# Altium project Runaway_Alarm.PrjPcb (part 3 of 3)

## Sheet IMU.SchDoc
size A; SheetNumber: 7; SheetTotal: 10
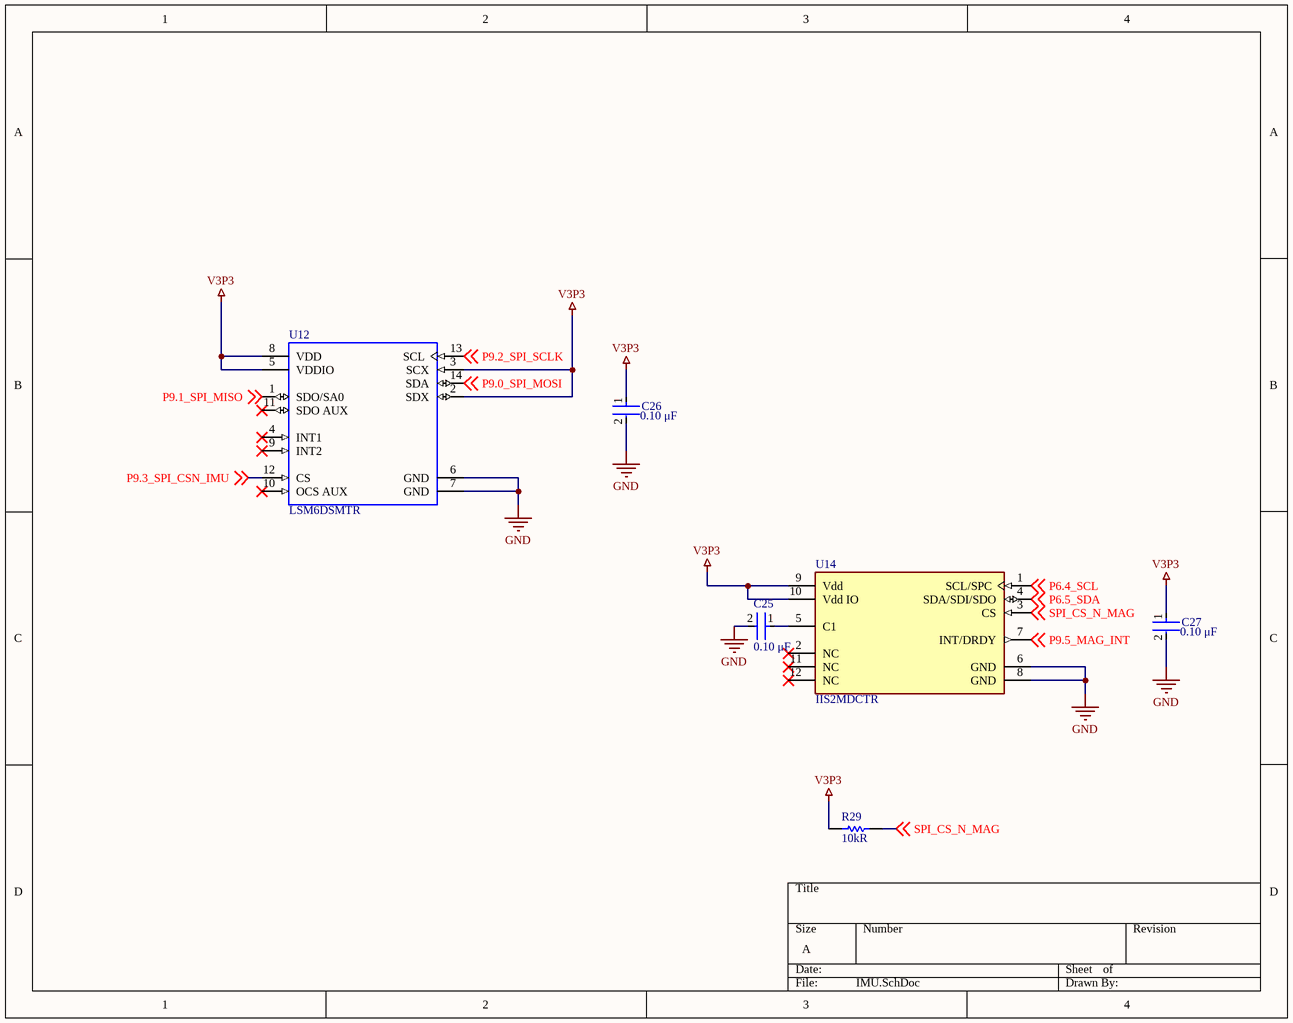
[diagram p6: IMU.SchDoc]

### Parts
C25  Capacitance: 0.10 μF  [FP-C0805C-DN-MFG]  (hidden comment: C0805C104K5RACTU)
C26  Capacitance: 0.10 μF  [FP-C0805C-DN-MFG]  (hidden comment: C0805C104K5RACTU)
C27  Capacitance: 0.10 μF  [FP-C0805C-DN-MFG]  (hidden comment: C0805C104K5RACTU)
R29  Resistance: 10kR  [RESC2013X60X35NL10T20]  (hidden comment: RC0805FR-0710KL)
U12  LSM6DSMTR  [LSM6DSMTR]
U14  IIS2MDCTR  [FP-LGA-12-DM00170568-MFG]

### Nets
GND: C25.2 C26.2 C27.2 U12.6(GND) U12.7(GND) U14.6(GND) U14.8(GND)
V3P3: C26.1 C27.1 R29.1 U12.2(SDX) U12.3(SCX) U12.5(VDDIO) U12.8(VDD) U14.9(Vdd) U14.10(Vdd_IO)
P6.4_SCL: U14.1(SCL/SPC) ; off-sheet P6.4_SCL
P6.5_SDA: U14.4(SDA/SDI/SDO) ; off-sheet P6.5_SDA
P9.0_SPI_MOSI: U12.14(SDA) ; off-sheet P9.0_SPI_MOSI
P9.1_SPI_MISO: U12.1(SDO/SA0) ; off-sheet P9.1_SPI_MISO
P9.2_SPI_SCLK: U12.13(SCL) ; off-sheet P9.2_SPI_SCLK
P9.3_SPI_CSN_IMU: U12.12(CS) ; off-sheet P9.3_SPI_CSN_IMU
P9.5_MAG_INT: U14.7(INT/DRDY) ; off-sheet P9.5_MAG_INT
SPI_CS_N_MAG: R29.2 U14.3(CS) ; off-sheet SPI_CS_N_MAG
NetC25_1: C25.1 U14.5(C1)

Not connected (* = marked no-connect by the designer): U12 4(INT1)* 9(INT2)* 10(OCS_AUX)* 11(SDO_AUX)*; U14 2(NC)* 11(NC)* 12(NC)*

### Library data of the parts
C25-C27 = CMP-2007-00279-2: CAP CER 0.1UF 50V X7R 0805; Manufacturer: KEMET; Value: 0.10 μF; Tolerance: 0.1; Temperature Coefficient: 30ppm/°C; Material: Ceramic; Voltage: 500V; Manufacturer Part Number: C0805C104K5RACTU; Device Class L2: Capacitors; Temperature Range Low: -55°C; Voltage Rating: 50 V; Digikey Description: CAP CER 0.1UF 50V X7R 0805; Category: Cap; ComponentLink2Description: Datasheet; Octopart: https://octopart.com/c0805c104k5ractu-kemet-143926; RoHS: TRUE; ComponentLink2URL: https://content.kemet.com/datasheets/KEM_C1003_C0G_SMD.pdf; Temperature Characteristic: X7R; Temperature: -55°C to +125°C; Height: 0.88mm; Temperature Range High: +125°C; Device Class L1: Passive Components; Automotive: No; Lead Free: Yes; Ipc Land Pattern Name: CAPC200125X78; Device Class L3: Ceramic Capacitors; Mouser Description: Cap Ceramic 0.1uF 50V X7R 10% SMD 2.0 x 1.2 mm 125 C Paper T/R; Package: C0805C-DN; Supplier: Digikey; Supplier Part Number: 399-C0805C104K5RAC7800CT-ND; Stock: 2466194; Pricing: 1=0.14, 10=0.091, 50=0.0546, 100=0.043, 500=0.03172, 1000=0.02627 (USD); Mounting Technology: Surface Mount,PCB; Case/Package: 0805; Pins: 2; Case Code (Imperial): 0805; Case Code (Metric): 2012; Min Operating Temperature: -55°C; Max Operating Temperature: 125°C; Dielectric: X7R; Package Quantity: 4000; Packaging: Tape and Reel; Voltage Rating (DC): 50V; Termination: SMD/SMT; Series: SMD Comm X7R; Construction: Flat; Length: 2mm; Width: 1.2mm; Depth: 1.25mm; Lead Pitch: 0.75mm; Radiation Hardening: No; RoHS Compliant: Yes; Reach SVHC Compliant: No; ComponentLink1URL: https://datasheet.ciiva.com/32431/slceramic-chip-condensers-e-32431755.pdf?src-supplier=Distrelec; ComponentLink1Description: https://datasheet.ciiva.com/32431/slceramic-chip-condensers-e-32431755.pdf?src-supplier=Distrelec; ComponentLink3URL: https://datasheet.ciiva.com/28682/1851736-28682232.pdf?src-supplier=Element14; ComponentLink3Description: https://datasheet.ciiva.com/28682/1851736-28682232.pdf?src-supplier=Element14; ComponentLink4URL: https://datasheet.ciiva.com/18410/70095383-18410815.pdf?src-supplier=Allied+Electronics; ComponentLink4Description: https://datasheet.ciiva.com/18410/70095383-18410815.pdf?src-supplier=Allied+Electronics; ComponentLink5URL: https://datasheet.ciiva.com/14589/70095383-14589048.pdf?src-supplier=Allied+Electronics; ComponentLink5Description: https://datasheet.ciiva.com/14589/70095383-14589048.pdf?src-supplier=Allied+Electronics
R29 = CMP-1659-00013-4: Chip Resistor, 10 KOhm, +/- 1%, 0.125 W, -55 to 155 degC, 0805 (2012 Metric), RoHS, Tape and Reel; Manufacturer: Yageo; Voltage Rating: 150 V; Power Rating: 125mW; Temperature Coefficient: 100ppm/°C; Mount: Surface Mount; ComponentLink1Description: Manufacturer URL; ComponentLink2URL: http://www.yageo.com/documents/recent/PYu-RC_Group_51_RoHS_L_04.pdf; Pins: 2; Length: 2 mm; Min Operating Temperature: -55 degC; Height: 0.5 mm; Mounting Technology: Surface Mount; RoHSCompliant: true; REACH SVHC: No SVHC; ComponentLink1URL: http://www.yageo.com/; Max Operating Temperature: 155 degC; PackageReference: 0805; DatasheetVersion: Rev. 4, 02/2016; Package Quantity: 5000; Packaging: Tape and Reel; ComponentLink2Description: Datasheet; PackageDescription: 2-Pin Surface Mounted Device, Body 2 x 1.25 mm; Supplier 1: Digi-Key; Supplier Part Number 1: 311-10.0KCRCT-ND; Manufacturer 1: Yageo; Manufacturer Part Number 1: RC0805FR-0710KL; RoHS: Yes; Category: Chip SMD Resistors; Stock 1: 12202331; Pricing 1: 1=0.10000, 10=0.03700, 100=0.01520, 1000=0.00682, 2500=0.00592 (USD); Case/Package: 0805; Case Code (Imperial): 0805; Case Code (Metric): 2012; Size Code: 0805; Tolerance: 1%; Termination: SMD/SMT; Series: RC; Max Power Dissipation: 125mW; Resistance Tolerance: 1%; Resistor Type: Thick Film; Number of Terminations: 2; Features: Moisture Resistant; Construction: Rectangular; Technology: THICK FILM; Width: 0.049inch; Depth: 1.25mm; RoHS Compliant: Yes; Lead Free: Lead Free; Military Standard: Not
U12 = IC-LSM6DSMTR: Analog Circuit, 1 Func, CMOS, PBGA14; Manufacturer: STMicroelectronics; Operating Supply Current: 0.29-0.65mA; Gyro Range: 125/250/500/1000/2000°/s; Sensor Output: I2C,SPI; Accel Range: 2/4/8/16g; Min Supply Voltage: 1.62V; Resolution: 16bits; Sensor Type: Temperature,Accelerometer,Gyroscope; Max Supply Voltage: 3.6V; Package Body Material: Plastic; Channels: 1; Nominal Supply Voltage: 1.8V; Manufacturer Part Number 1: LSM6DSMTR; Octopart: https://octopart.com/lsm6dsmtr-stmicroelectronics-66358194; Height: 0.86mm; Category: IC; Lead Free: Yes; Temperature: -40°C to +85°C; Temperature Range Low: -40°C; ComponentLink2Description: Datasheet; ComponentLink2URL: https://www.st.com/resource/en/datasheet/lsm6dsm.pdf; Digikey Description: IMU ACCEL/GYRO I2C/SPI 14LGA; Footprint Url: https://www.st.com/content/ccc/resource/technical/document/technical_note/73/17/9c/16/dd/96/4a/01/CD00134799.pdf/files/CD00134799.pdf/jcr:content/translations/en.CD00134799.pdf; Device Class L1: Sensors; Device Class L2: Motion Sensors; Temperature Range High: +85°C; Mouser Description: LSM6DSM Series 3.6 V I2C/SPI 3D Accelerometer and 3D Gyroscope - LGA-14; Device Class L3: Inertial Measurement Units (IMUs); Automotive: No; Package: LGA-14L-DM00249496; RoHS: TRUE; Supplier 1: Digikey; Supplier Part Number 1: 497-16696-1-ND; Stock: 16933; Pricing: 1=3.92, 10=2.965, 25=2.7248, 100=2.461, 250=2.33524, 500=2.25944, 1000=2.19705, 2500=2.13118 (USD); Case/Package: VFLGA; Pins: 14; Package Shape: Rectangular; Terminal Finish: Nickel; Min Operating Temperature: -40°C; Max Operating Temperature: 85°C; JESD-609 Code: e4; Throw Configuration: ANALOG CIRCUIT; Moisture Sensitivity Level: 3; Package Style: GRID ARRAY, VERY THIN PROFILE, FINE PITCHMeter; Peak Reflow Temperature (Cel): 260°C; Surface Mount: Yes; Technology: CMOS; Terminal Form: BUTT; Terminal Position: BOTTOM; Length: 3mm; Width: 2.5mm; Height - Seated (Max): 0.86mm; Terminal Pitch: 0.5mm; Temperature Grade: INDUSTRIAL; Reach SVHC Compliant: Yes; RoHS Compliant: Yes; ComponentLink1URL: https://datasheet.ciiva.com:443/pdfs/VipMasterIC/IC/SGST/SGST-S-A0003491949/SGST-S-A0003491926-1.pdf?src-supplier=IHS+Markit; ComponentLink1Description: https://datasheet.ciiva.com:443/pdfs/VipMasterIC/IC/SGST/SGST-S-A0003491949/SGST-S-A0003491926-1.pdf?src-supplier=IHS+Markit; ComponentLink3URL: http://www.farnell.com/datasheets/2151220.pdf?src-supplier=Farnell; ComponentLink3Description: http://www.farnell.com/datasheets/2151220.pdf?src-supplier=Farnell; ComponentLink4URL: https://www.mouser.com/ds/2/389/lsm6dsm-973702.pdf?src-supplier=Mouser; ComponentLink4Description: https://www.mouser.com/ds/2/389/lsm6dsm-973702.pdf?src-supplier=Mouser; ComponentLink5URL: http://www.st.com/content/ccc/resource/sales_and_marketing/promotional_material/flyer/7a/04/ee/af/e2/19/46/66/fllsm6dsm0216.pdf/files/fllsm6dsm0216.pdf/jcr:content/translations/en.fllsm6dsm0216.pdf?src-supplier=Digikey; ComponentLink5Description: http://www.st.com/content/ccc/resource/sales_and_marketing/promotional_material/flyer/7a/04/ee/af/e2/19/46/66/fllsm6dsm0216.pdf/files/fllsm6dsm0216.pdf/jcr:content/translations/en.fllsm6dsm0216.pdf?src-supplier=Digikey; ComponentLink6URL: http://www.st.com/content/ccc/resource/technical/document/datasheet/76/27/cf/88/c5/03/42/6b/DM00218116.pdf/files/DM00218116.pdf/jcr:content/translations/en.DM00218116.pdf?src-supplier=Digikey; ComponentLink6Description: http://www.st.com/content/ccc/resource/technical/document/datasheet/76/27/cf/88/c5/03/42/6b/DM00218116.pdf/files/DM00218116.pdf/jcr:content/translations/en.DM00218116.pdf?src-supplier=Digikey; ComponentLink7URL: https://datasheet.octopart.com/LSM6DSMTR-STMicroelectronics-datasheet-62333594.pdf?src-supplier=Newark; ComponentLink7Description: https://datasheet.octopart.com/LSM6DSMTR-STMicroelectronics-datasheet-62333594.pdf?src-supplier=Newark; ComponentLink8URL: http://www.farnell.com/datasheets/2151220.pdf?src-supplier=Newark; ComponentLink8Description: http://www.farnell.com/datasheets/2151220.pdf?src-supplier=Newark; ComponentLink9URL: https://datasheet.octopart.com/LSM6DSMTR-STMicroelectronics-datasheet-79471837.pdf?src-supplier=Future+Electronics; ComponentLink9Description: https://datasheet.octopart.com/LSM6DSMTR-STMicroelectronics-datasheet-79471837.pdf?src-supplier=Future+Electronics
U14 = CMP-12173-000003-1: SENSOR MR I2C/SPI 12LGA; Axis: X, Y, Z; Output Type: SPI; Sensing Method: Magnetoresistive; Resolution: 16b; Case/Package: LGA; Min Operating Temperature: -40°C; Packaging: Cut Tape; Number of Pins: 12; Max Operating Temperature: 85°C; RoHS Compliant: Yes

## Sheet Carrier_MCU.SchDoc: PSoC6
size A; Revision: A; SheetNumber: 8; SheetTotal: 10; ECE315_Project_Name: ECE453 F25 Staff Dev Board
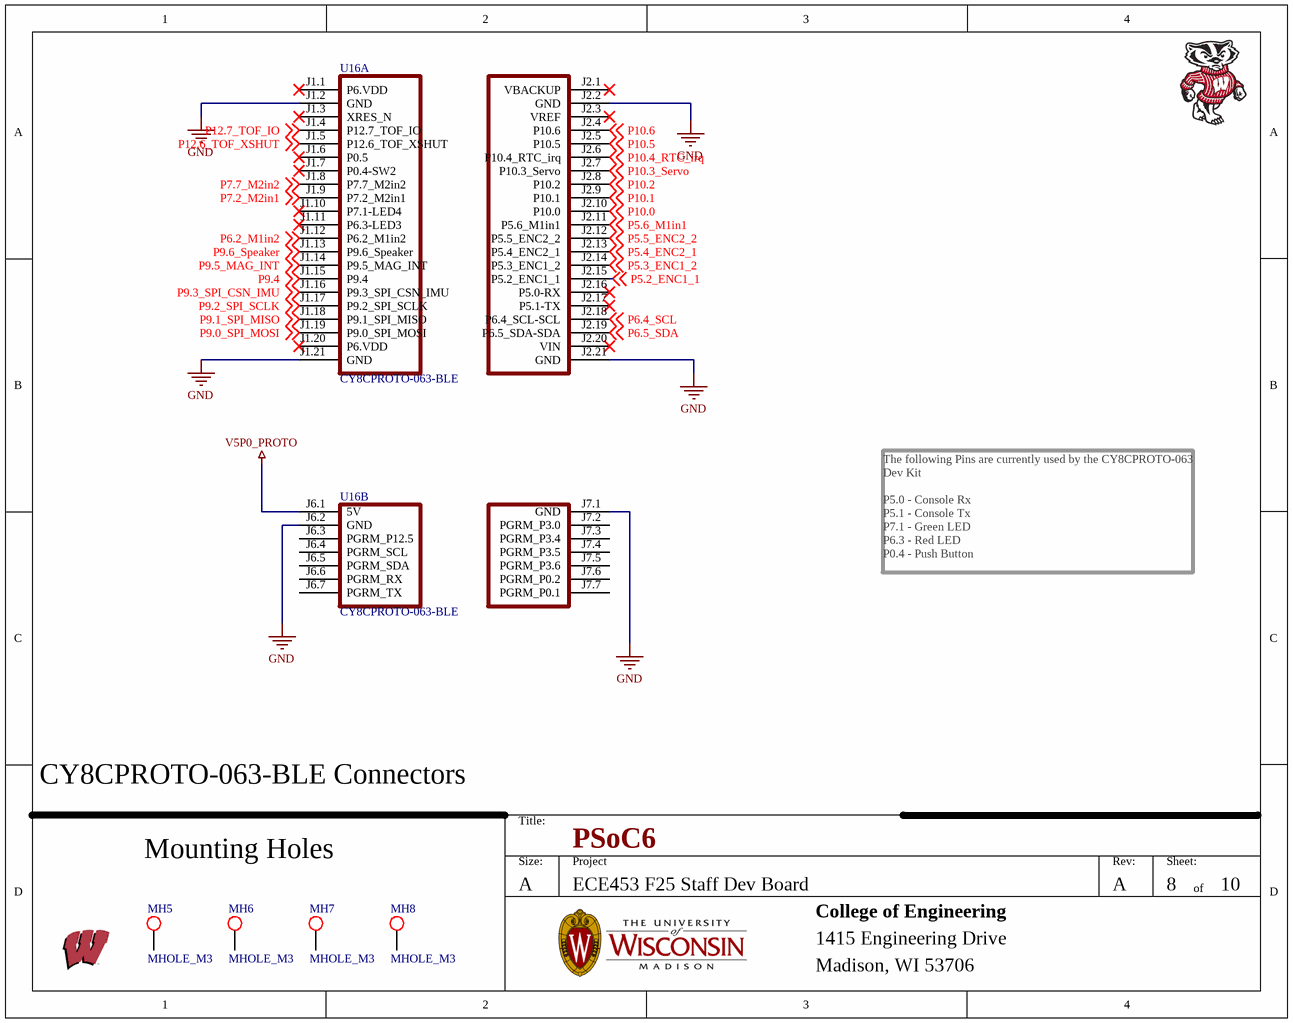
[diagram p7: Carrier_MCU.SchDoc]

### Parts
MH5  MHOLE_M3  [MHOLE_M3]  (no BOM)
MH6  MHOLE_M3  [MHOLE_M3]  (no BOM)
MH7  MHOLE_M3  [MHOLE_M3]  (no BOM)
MH8  MHOLE_M3  [MHOLE_M3]  (no BOM)
U16  CY8CPROTO-063-BLE  [CY8CPROTO-063-BLE]  (parts A,B of 2)  (no BOM)

### Nets
GND: U16.J1.2(GND) U16.J1.21(GND) U16.J2.2(GND) U16.J2.21(GND) U16.J6.2(GND) U16.J7.1(GND)
V5P0_PROTO: U16.J6.1(5V)
P5.2_ENC1_1: U16.J2.15(P5.2_ENC1_1) ; off-sheet P5.2_ENC1_1
P5.3_ENC1_2: U16.J2.14(P5.3_ENC1_2) ; off-sheet P5.3_ENC1_2
P5.4_ENC2_1: U16.J2.13(P5.4_ENC2_1) ; off-sheet P5.4_ENC2_1
P5.5_ENC2_2: U16.J2.12(P5.5_ENC2_2) ; off-sheet P5.5_ENC2_2
P5.6_M1in1: U16.J2.11(P5.6_M1in1) ; off-sheet P5.6_M1in1
P6.2_M1in2: U16.J1.12(P6.2_M1in2) ; off-sheet P6.2_M1in2
P6.4_SCL: U16.J2.18(P6.4_SCL-SCL) ; off-sheet P6.4_SCL
P6.5_SDA: U16.J2.19(P6.5_SDA-SDA) ; off-sheet P6.5_SDA
P7.2_M2in1: U16.J1.9(P7.2_M2in1) ; off-sheet P7.2_M2in1
P7.7_M2in2: U16.J1.8(P7.7_M2in2) ; off-sheet P7.7_M2in2
P9.0_SPI_MOSI: U16.J1.19(P9.0_SPI_MOSI) ; off-sheet P9.0_SPI_MOSI
P9.1_SPI_MISO: U16.J1.18(P9.1_SPI_MISO) ; off-sheet P9.1_SPI_MISO
P9.2_SPI_SCLK: U16.J1.17(P9.2_SPI_SCLK) ; off-sheet P9.2_SPI_SCLK
P9.3_SPI_CSN_IMU: U16.J1.16(P9.3_SPI_CSN_IMU) ; off-sheet P9.3_SPI_CSN_IMU
P9.4: U16.J1.15(P9.4) ; off-sheet P9.4
P9.5_MAG_INT: U16.J1.14(P9.5_MAG_INT) ; off-sheet P9.5_MAG_INT
P9.6_Speaker: U16.J1.13(P9.6_Speaker) ; off-sheet P9.6_Speaker
P10.0: U16.J2.10(P10.0) ; off-sheet P10.0
P10.1: U16.J2.9(P10.1) ; off-sheet P10.1
P10.2: U16.J2.8(P10.2) ; off-sheet P10.2
P10.3_Servo: U16.J2.7(P10.3_Servo) ; off-sheet P10.3_Servo
P10.4_RTC_irq: U16.J2.6(P10.4_RTC_irq) ; off-sheet P10.4_RTC_irq
P10.5: U16.J2.5(P10.5) ; off-sheet P10.5
P10.6: U16.J2.4(P10.6) ; off-sheet P10.6
P12.6_TOF_XSHUT: U16.J1.5(P12.6_TOF_XSHUT) ; off-sheet P12.6_TOF_XSHUT
P12.7_TOF_IO: U16.J1.4(P12.7_TOF_IO) ; off-sheet P12.7_TOF_IO

Not connected (* = marked no-connect by the designer): MH5 1; MH6 1; MH7 1; MH8 1; U16 J1.1(P6.VDD)* J1.3(XRES_N)* J1.6(P0.5)* J1.7(P0.4-SW2)* J1.10(P7.1-LED4)* J1.11(P6.3-LED3)* J1.20(P6.VDD)* J2.1(VBACKUP)* J2.3(VREF)* J2.16(P5.0-RX)* J2.17(P5.1-TX)* J2.20(VIN)* J6.3(PGRM_P12.5) J6.4(PGRM_SCL) J6.5(PGRM_SDA) J6.6(PGRM_RX) J6.7(PGRM_TX) J7.2(PGRM_P3.0) J7.3(PGRM_P3.4) J7.4(PGRM_P3.5) J7.5(PGRM_P3.6) J7.6(PGRM_P0.2) J7.7(PGRM_P0.1)

### Notes on the sheet
- The following Pins are currently used by the CY8CPROTO-063 Dev Kit
  P5.0 - Console Rx
  P5.1 - Console Tx
  P7.1 - Green LED
  P6.3 - Red LED
  P0.4 - Push Button
- CY8CPROTO-063-BLE Connectors
- Mounting Holes
- Title:
- Size:
- A
- Project
- Rev:
- Sheet:
- of
- College of Engineering
- 1415 Engineering Drive
- Madison, WI 53706

### Library data of the parts
MH5-MH8 = MHOLE_M3: Mounting Hole - M3 Metric
U16 = IC_CY8CPROTO-063-BLE

## Sheet Carrier_Power.SchDoc: Power
size A; Revision: A; SheetNumber: 11; SheetTotal: 12; ECE315_Project_Name: ECE453 F25 Staff Dev Board
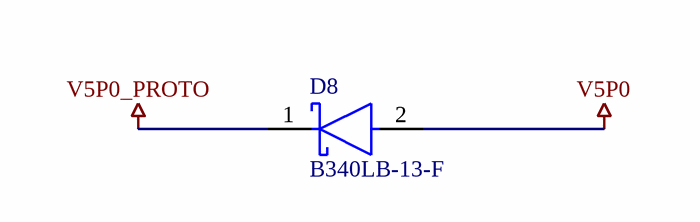
[diagram p8: Carrier_Power.SchDoc]

### Parts
D8  B340LB-13-F  [FP-SMB-MFG]

### Nets
V5P0: D8.2(A)
V5P0_PROTO: D8.1(C)

### Notes on the sheet
- Title:
- Size:
- A
- Project
- Rev:
- Sheet:
- of
- College of Engineering
- 1415 Engineering Drive
- Madison, WI 53706

### Library data of the parts
D8 = CMP-12790-000022-1: DIODE SCHOTTKY 40V 3A SMB; Manufacturer: Diodes Inc.; Max Surge Forward Current: 70A; Value: 180pF; Peak Reverse Current: 2mA; Standoff Height: 0.05mm; Max Junction Temp: +150°C; Device Class L2: Diodes; Octopart: https://octopart.com/b340lb-13-f-diodes+inc.-325823; Device Class L1: Discrete Semiconductors; Forward Current: 3A; Automotive: No; Manufacturer Part Number: B340LB-13-F; Temperature: -55°C to +150°C; Temperature Range Low: -55°C; Max Repetitive Reverse Voltage: 40V; Device Class L3: Schottky Diodes; RoHS: TRUE; Height: 2.5mm; ComponentLink2URL: https://www.diodes.com/assets/Datasheets/ds30240.pdf; Package: SMB; Digikey Description: DIODE SCHOTTKY 40V 3A SMB; Lead Free: Yes; Category: Diode; Reverse Voltage: 40V; Mouser Description: Schottky Diodes & Rectifiers 40V 3A; ComponentLink2Description: Datasheet; Footprint Url: https://www.diodes.com/assets/Package-Files/SMB.pdf; Temperature Range High: +150°C; Capacitance: 180pF

## Sheet Speaker.SchDoc
size A; SheetNumber: 11; SheetTotal: 11
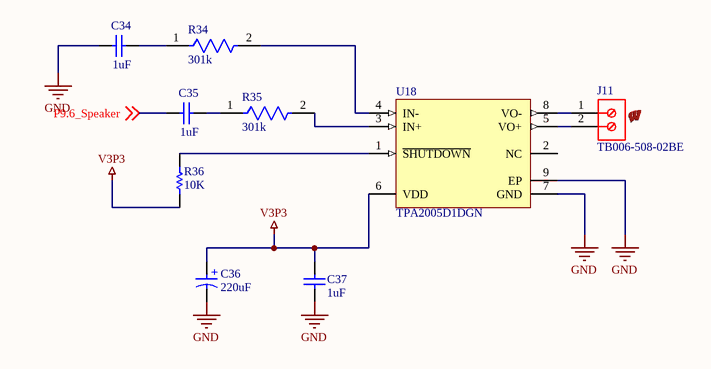
[diagram p9: Speaker.SchDoc]

### Parts
C34  1uF  [CAPC2013X145X50NL20T25]
C35  1uF  [CAPC2013X145X50NL20T25]
C36  220uF  [WCAP-AS5H_D6.3H7.7]
C37  1uF  [CAPC2013X145X50NL20T25]
J11  Manufacturer Part Number: TB006-508-02BE  [CUI_TB006 -508-02BE]  (hidden comment: CONN_TB006_-508-02BE)
R34  301k  [FP-CRCW1206-Pe3-MFG]
R35  301k  [FP-CRCW1206-Pe3-MFG]
R36  10K  [RESC2013X55X40ML15T20]
U18  TPA2005D1DGN  [DGN0008D_L]

### Nets
GND: C34.1 C36.2(N) C37.1 U18.7(GND) U18.9(EP)
V3P3: C36.1(P) C37.2 R36.1 U18.6(VDD)
P9.6_Speaker: C35.1 ; off-sheet P9.6_Speaker
NetC34_2: C34.2 R34.1
NetC35_2: C35.2 R35.1
NetJ11_1: J11.1 U18.8(VO-)
NetJ11_2: J11.2 U18.5(VO+)
NetR34_2: R34.2 U18.4(IN-)
NetR35_2: R35.2 U18.3(IN+)
NetR36_2: R36.2 U18.1(~{SHUTDOWN})

Not connected (* = marked no-connect by the designer): U18 2(NC)

### Notes on the sheet
- (in symbol CMP-03913-53914664-1) +

### Library data of the parts
C34 C35 C37 = CMP-2007-01227-1: Manufacturer: Kemet; Part Number: C0805S104K5RACTU
C36 = CMP-03913-53914664-1: 865230145005 WCAP-AS5H Aluminum Electrolytic Capacitors; Insulation Resistance: 454.545kΩ; Ripple Current (AC): 110mA; Leakage Current: 13.86µA; Life (Hours): 5000hours; Voltage Rating (DC): 6.3V; Capacitance: 220µF; Ripple Current: 110mA; Diameter: 6.3mm; NexarPartId: 53914664; Packaging: Cut Tape; Height: 7.7mm; Max Operating Temperature: 105°C; REACH SVHC: Unknown; RoHS: Compliant; Width: 6.6mm; Length: 7.7mm; Case/Package: Radial; Voltage Rating: 6.3V; Min Operating Temperature: -40°C
J11 = CONN_TB006_-508-02BE: 2~24 Poles, Screw Type, Horizontal, 5.08 Pitch, 26~14 (AWG), Terminal Block Connector; MF: CUI Devices; MP: TB006 -508-02BE; CUI_purchase_URL: https://www.cuidevices.com/product/interconnect/connectors/terminal-blocks/tb006-508-series?utm_source=snapeda.com&utm_medium=referral&utm_campaign=snapedaBOM; Value: *; Check_prices: https://www.snapeda.com/parts/TB006%20-508-02BE/CUI+Devices/view-part/?ref=eda; SnapEDA_Link: https://www.snapeda.com/parts/TB006%20-508-02BE/CUI+Devices/view-part/?ref=snap; Availability: In Stock; Package: None; Purchase-URL: https://pricing.snapeda.com/search/part/TB006 -508-02BE/?ref=eda; Price: None; Supplier: Digikey; Supplier Part Number: 102-6191-ND; Manufacturer: CUI Devices; RoHS: Yes; Category: Terminal Blocks; Stock: 47249; Pricing: 1=0.73, 10=0.402, 25=0.3, 50=0.2676, 100=0.2623, 250=0.23084, 500=0.20984, 1000=0.18886, 5000=0.14164 (USD)
R34 R35 = CMP-03613-000233-1: RES Thick Film, 301kΩ, 1%, 0.25W, 50ppm/°C, 1206; Resistance: 301kR; Max Power Dissipation: 250mW; Number of Terminations: 2; Series: CRCW-P; Resistor Type: Thick Film; RoHS Compliant: Yes; Max Operating Temperature: 155°C; Features: Automotive AEC-Q200; Case/Package: 1206; Packaging: Tape and Reel; Package Quantity: 5000; Tolerance: 1%; Min Operating Temperature: -55°C; Temperature Coefficient: 50ppm/°C; Width: 0.063inch; Height: 0.024inch; Length: 0.126inch
R36 = CMP-2001-04711-1: Part Number: TNPW0805301KBEEN; Manufacturer: Vishay Dale
U18 = CMP-0991-00091-2: 1.4-W Mono Class-D Audio Amplifier, -40 to 85 degC, 8-pin SOP (DGN8), Green (RoHS & no Sb/Br); Manufacturer: Texas Instruments; Supply Min(Min)(Volt): 2.5; SubFamily: Dynamic Speaker; Supply Max(Max)(Volt): 5.5; Output Power(W): 1.18; PSRR(dB): -75; ComponentLink1Description: Manufacturer URL; Mounting Technology: Surface Mount; Code_JEDEC: MO-187; PackageReference: DGN0008D; PackageDescription: 8-Pin Plastic Small Outline, Body 3 x 3 mm, Pitch 0.65 mm; Eco-Plan: Green (RoHS & no Sb/Br); ComponentLink3Description: Package Specification; ComponentLink1URL: http://www.ti.com/; PackageVersion: 4073271/F, 05/2011; ComponentLink2Description: Datasheet; DatasheetVersion: SLOS369F; Speaker Amp Type: Class-D; Speaker Channels: Mono; PartNumber: TPA2005D1DGN; ComponentLink3URL: http://www.ti.com/litv/pdf/mpds046e; ComponentLink2URL: http://www.ti.com/general/docs/lit/getliterature.tsp?genericPartNumber=TPA2005D1&fileType=pdf

## Nets that join several sheets
GND: 02-RTC (5 pins), 03-Batteries (5 pins), 04-Power-V3P3 (9 pins), 05-Power-V5P0 (9 pins), driver1 (11 pins), driver2 (10 pins), IMU (7 pins), Carrier_MCU (6 pins), Speaker (5 pins)
V3P3: 02-RTC (5 pins), 03-Batteries (TOF.2 V3P3.1), 04-Power-V3P3 (5 pins), driver1 (C4.1 ENC1.1 U10.4), driver2 (C28.1 ENC2.1 U11.4), IMU (9 pins), Speaker (C36.1 C37.2 R36.1 U18.6)
V5P0: 03-Batteries (LCD.2 SERVO1.2 V5P0.1), 05-Power-V5P0 (5 pins), Carrier_Power (D8.2)
V5P0_PROTO: Carrier_MCU (U16.J6.1), Carrier_Power (D8.1)
VBATT: 03-Batteries (BT2.P VBATT.1), 04-Power-V3P3 (Q1.3 R12.2), 05-Power-V5P0 (Q2.3 R16.2), driver1 (6 pins), driver2 (5 pins)
P5.2_ENC1_1: driver1 (ENC1.2), Carrier_MCU (U16.J2.15)
P5.3_ENC1_2: driver1 (ENC1.3), Carrier_MCU (U16.J2.14)
P5.4_ENC2_1: driver2 (ENC2.2), Carrier_MCU (U16.J2.13)
P5.5_ENC2_2: driver2 (ENC2.3), Carrier_MCU (U16.J2.12)
P5.6_M1in1: driver1 (U10.3), Carrier_MCU (U16.J2.11)
P6.2_M1in2: driver1 (U10.2), Carrier_MCU (U16.J1.12)
P6.4_SCL: 02-RTC (R1.2 U1.6), 03-Batteries (LCD.4 SCL.1 TOF.3), IMU (U14.1), Carrier_MCU (U16.J2.18)
P6.5_SDA: 02-RTC (R2.2 U1.5), 03-Batteries (LCD.3 SDA.1 TOF.4), IMU (U14.4), Carrier_MCU (U16.J2.19)
P7.2_M2in1: driver2 (U11.3), Carrier_MCU (U16.J1.9)
P7.7_M2in2: driver2 (U11.2), Carrier_MCU (U16.J1.8)
P9.0_SPI_MOSI: IMU (U12.14), Carrier_MCU (U16.J1.19)
P9.1_SPI_MISO: IMU (U12.1), Carrier_MCU (U16.J1.18)
P9.2_SPI_SCLK: IMU (U12.13), Carrier_MCU (U16.J1.17)
P9.3_SPI_CSN_IMU: IMU (U12.12), Carrier_MCU (U16.J1.16)
P9.4: 03-Batteries (Exposed_Pins.1), Carrier_MCU (U16.J1.15)
P9.5_MAG_INT: IMU (U14.7), Carrier_MCU (U16.J1.14)
P9.6_Speaker: Carrier_MCU (U16.J1.13), Speaker (C35.1)
P10.0: 03-Batteries (Exposed_Pins.2), Carrier_MCU (U16.J2.10)
P10.1: 03-Batteries (Exposed_Pins.3), Carrier_MCU (U16.J2.9)
P10.2: 03-Batteries (Exposed_Pins.4), Carrier_MCU (U16.J2.8)
P10.3_Servo: 03-Batteries (SERVO1.3), Carrier_MCU (U16.J2.7)
P10.4_RTC_irq: 02-RTC (R3.2 U1.7), Carrier_MCU (U16.J2.6)
P10.5: 03-Batteries (Exposed_Pins.5), Carrier_MCU (U16.J2.5)
P10.6: 03-Batteries (Exposed_Pins.6), Carrier_MCU (U16.J2.4)
P12.6_TOF_XSHUT: 03-Batteries (TOF.5), Carrier_MCU (U16.J1.5)
P12.7_TOF_IO: 03-Batteries (TOF.6), Carrier_MCU (U16.J1.4)